# Altium schematic sheet ETH.SchDoc
size C; SheetNumber: 7; SheetTotal: 8
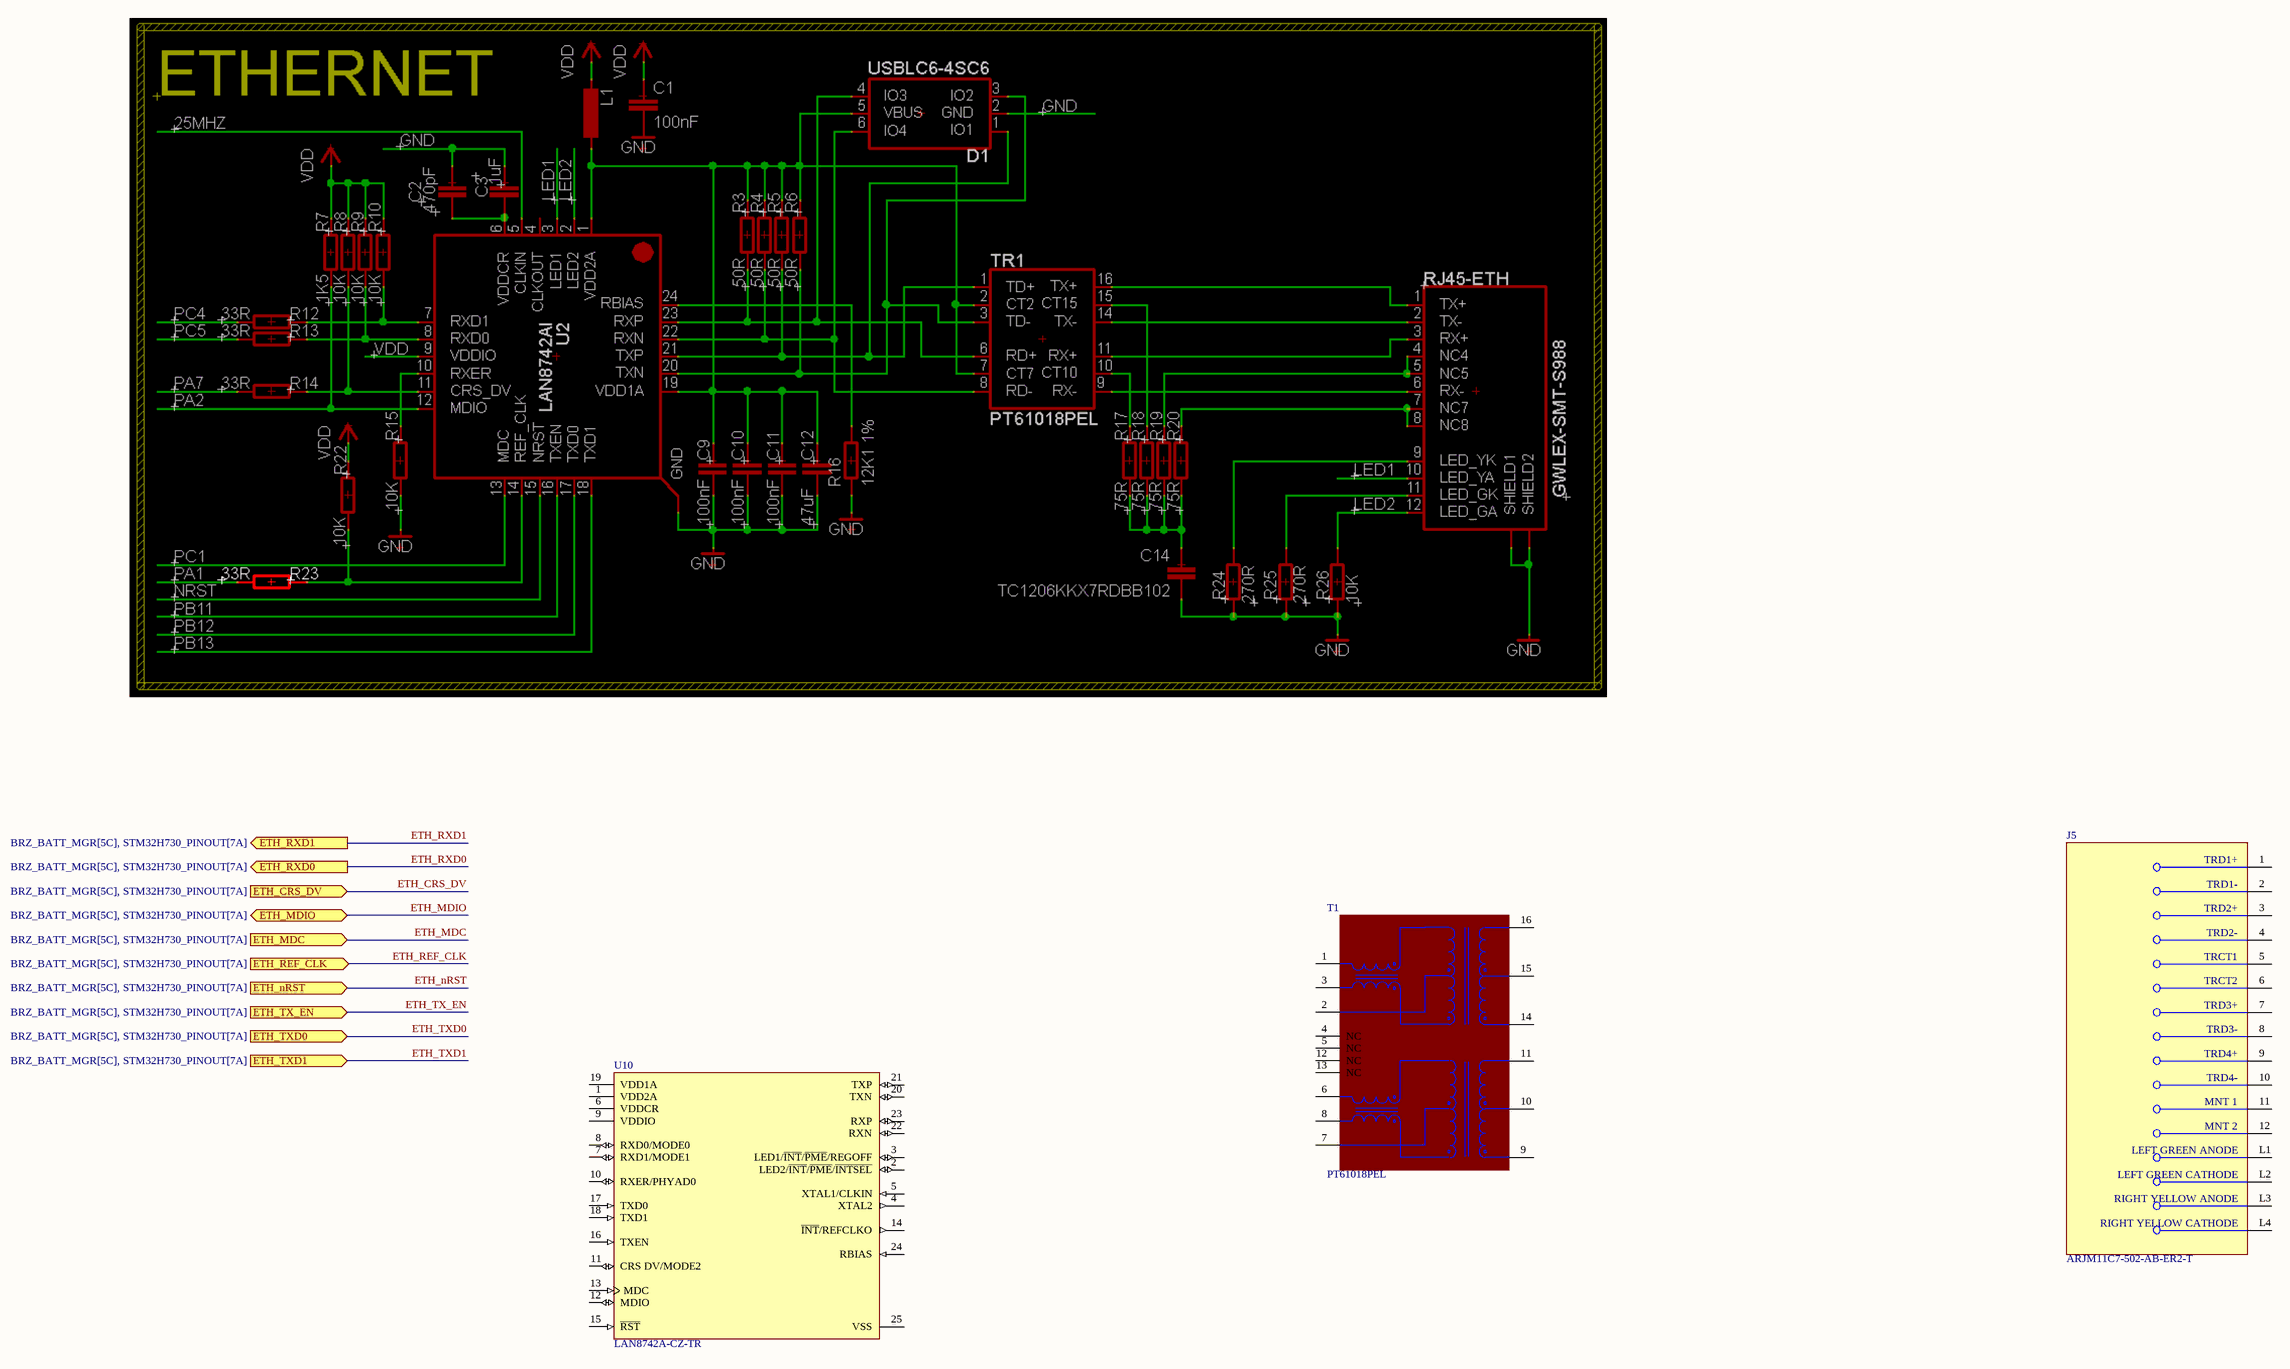
[diagram p0: ETH.SchDoc]

## Parts
J5  ARJM11C7-502-AB-ER2-T  [FP-ARJM11C7-502-AB-ER2-T-MFG]
T1  PT61018PEL  [FP-PT61018PEL-MFG]
U10  LAN8742A-CZ-TR  [FP-C04-143B-S4QFN-MFG]

## Ports
ETH_CRS_DV (in, see BRZ_BATT_MGR[5C], STM32H730_PINOUT[7A]), ETH_MDC (in, see BRZ_BATT_MGR[5C], STM32H730_PINOUT[7A]), ETH_MDIO (bidir, see BRZ_BATT_MGR[5C], STM32H730_PINOUT[7A]), ETH_nRST (in, see BRZ_BATT_MGR[5C], STM32H730_PINOUT[7A]), ETH_REF_CLK (in, see BRZ_BATT_MGR[5C], STM32H730_PINOUT[7A]), ETH_RXD0 (out, see BRZ_BATT_MGR[5C], STM32H730_PINOUT[7A]), ETH_RXD1 (out, see BRZ_BATT_MGR[5C], STM32H730_PINOUT[7A]), ETH_TX_EN (in, see BRZ_BATT_MGR[5C], STM32H730_PINOUT[7A]), ETH_TXD0 (in, see BRZ_BATT_MGR[5C], STM32H730_PINOUT[7A]), ETH_TXD1 (in, see BRZ_BATT_MGR[5C], STM32H730_PINOUT[7A])

## Nets
ETH_CRS_DV: port ETH_CRS_DV
ETH_MDC: port ETH_MDC
ETH_MDIO: port ETH_MDIO
ETH_nRST: port ETH_nRST
ETH_REF_CLK: port ETH_REF_CLK
ETH_RXD0: port ETH_RXD0
ETH_RXD1: port ETH_RXD1
ETH_TX_EN: port ETH_TX_EN
ETH_TXD0: port ETH_TXD0
ETH_TXD1: port ETH_TXD1

Not connected (* = marked no-connect by the designer): J5 1(TRD1+) 2(TRD1-) 3(TRD2+) 4(TRD2-) 5(TRCT1) 6(TRCT2) 7(TRD3+) 8(TRD3-) 9(TRD4+) 10(TRD4-) 11(MNT_1) 12(MNT_2) L1(LEFT_GREEN_ANODE) L2(LEFT_GREEN_CATHODE) L3(RIGHT_YELLOW_ANODE) L4(RIGHT_YELLOW_CATHODE); T1 1(TD+) 2(CT) 3(TD-) 4(NC) 5(NC) 6(RD+) 7(CT) 8(RD-) 9(RX-) 10(CT) 11(RX+) 12(NC) 13(NC) 14(TX-) 15(CT) 16(TX+); U10 1(VDD2A) 2(LED2/~{INT}/~{PME}/~{INTSEL}) 3(LED1/~{INT}/~{PME}/REGOFF) 4(XTAL2) 5(XTAL1/CLKIN) 6(VDDCR) 7(RXD1/MODE1) 8(RXD0/MODE0) 9(VDDIO) 10(RXER/PHYAD0) 11(CRS_DV/MODE2) 12(MDIO) 13(MDC) 14(~{INT}/REFCLKO) 15(~{RST}) 16(TXEN) 17(TXD0) 18(TXD1) 19(VDD1A) 20(TXN) 21(TXP) 22(RXN) 23(RXP) 24(RBIAS) 25(VSS)

## Library data of the parts
J5 = CMP-27893-000001-1: RJ45 JACK W/MAG 1X1 1000BASE-T; Manufacturer: Abracon; Conn Gender: Female; Is Female: yes; Shielding: true; Pitch: 1.27mm; Number Of Contacts: 10; Conn Orientation: Right Angle; RoHS: TRUE; Digikey Description: RJ45 JACK W/MAG 1X1 1000BASE-T; Temperature Range Low: -40°C; ComponentLink2Description: Datasheet; Category: Conn; Temperature Range High: +85°C; Package: 0; Device Class L1: Connectors; Manufacturer Part Number: ARJM11C7-502-AB-ER2-T; ComponentLink2URL: https://abracon.com/Magnetics/ARJM11.pdf; Automotive: No; Contact Material: Gold; Height: 15.8mm; Lead Free: Yes; Temperature: -40°C to +85°C; Device Class L2: Modular / Ethernet Connectors; Device Class L3: unset; Octopart: https://octopart.com/arjm11c7-502-ab-er2-t-abracon-86945316
T1 = CMP-07264-000008-1: PULSE XFMR 1CT:1CT 350UH; Max DC Current: 8mA; Shielding: Shielded; Lead/Base Style: Gull Wing; Isolation Voltage: 1.5kV; Turns Ratio: 1:1; DC Resistance (DCR): 1.2R; Weight: 0.02575oz; Termination: SMD/SMT; RoHS Compliant: Yes; Length: 12.8mm; Max Operating Temperature: 85°C; Inductance: 350uH; Mount: Surface Mount; Width: 6.9mm; Height: 5.65mm; Packaging: Tape and Reel; Case/Package: SMD/SMT; Number of Pins: 16; Min Operating Temperature: -40°C; Package Quantity: 600
U10 = CMP-06281-000006-2: IC TRANSCEIVER 1/1 24SQFN; Manufacturer: Microchip; Nominal Supply Current: 6.5-59mA; Max Supply Voltage: 3.6V; Number Of Channels: 1; Data Rate: 100Mbits/s; Interface: Ethernet,Other; Min Supply Voltage: 1.14V; Standoff Height: 0mm; Simplex Duplex: Full-Duplex; Height: 1mm; Ambient Temperature Range High: +70°C; Category: IC; Mouser Description: Small Footprint RMII 10/100 Ethernet Transceiver with flexPWR Technology; Manufacturer Part Number: LAN8742A-CZ-TR; Digikey Description: IC TRANSCEIVER 1/1 24SQFN; Octopart: https://octopart.com/lan8742a-cz-tr-microchip-29030587; Temperature: 0°C to +70°C; Ambient Temperature Range Low: 0°C; Temperature Range Low: 0°C; ComponentLink2Description: Datasheet; Automotive: No; RoHS: TRUE; Device Class L3: Ethernet Interface ICs; Device Class L1: Integrated Circuits (ICs); Device Class L2: Interface ICs; Lead Free: Yes; Ipc Land Pattern Name: QFN50P400X400X90-24; ComponentLink2URL: http://ww1.microchip.com/downloads/en/DeviceDoc/DS_LAN8742_00001989A.pdf; Temperature Range High: +70°C; Package: C04-143B-S4QFN